# Altium schematic sheet BSU_EADC.SchDoc: ADC
size A4; Sub Team: EEE; Organization: PERT; SheetNumber: 7; SheetTotal: 8
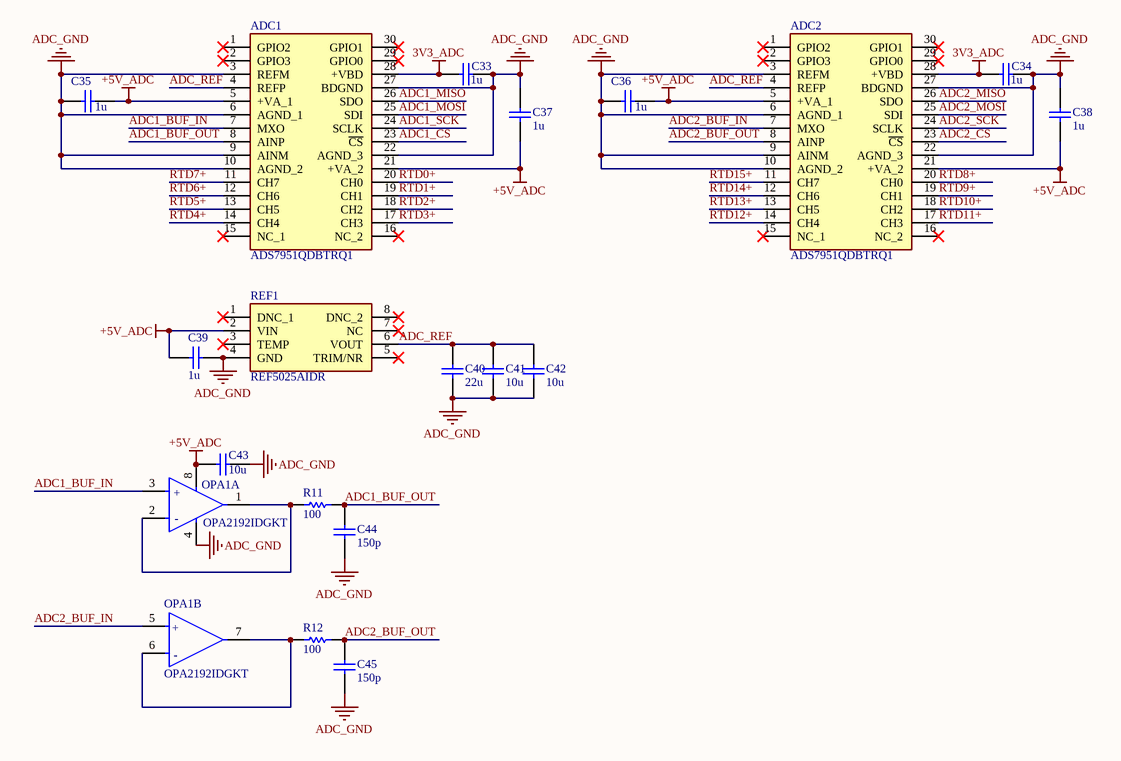
[diagram p0: BSU_EADC.SchDoc]

## Parts
ADC1  ADS7951QDBTRQ1  [TSSOP30_ADS7951]
ADC2  ADS7951QDBTRQ1  [TSSOP30_ADS7951]
C33  1u  [0805_SMD_C]
C34  1u  [0805_SMD_C]
C35  1u  [0805_SMD_C]
C36  1u  [0805_SMD_C]
C37  1u  [0805_SMD_C]
C38  1u  [0805_SMD_C]
C39  1u  [0805_SMD_C]
C40  22u  [0805_SMD_C]
C41  10u  [0805_SMD_C]
C42  10u  [0805_SMD_C]
C43  10u  [0805_SMD_C]
C44  150p  [0805_SMD_C]
C45  150p  [0805_SMD_C]
OPA1  OPA2192IDGKT  [VSSOP8_OPA2192]  (parts A,B of 2)
R11  100  [0805_SMD_R]
R12  100  [0805_SMD_R]
REF1  REF5025AIDR  [SOIC8_REF5025]

## Nets
3V3_ADC: ADC1.28(+VBD) ADC2.28(+VBD) C33.1 C34.1
+5V_ADC: ADC1.5(+VA_1) ADC1.21(+VA_2) ADC2.5(+VA_1) ADC2.21(+VA_2) C35.1 C36.1 C37.2 C38.2 C39.1 C43.2 OPA1.8(VDD) REF1.2(VIN)
ADC_GND: ADC1.3(REFM) ADC1.6(AGND_1) ADC1.9(AINM) ADC1.10(AGND_2) ADC1.22(AGND_3) ADC1.27(BDGND) ADC2.3(REFM) ADC2.6(AGND_1) ADC2.9(AINM) ADC2.10(AGND_2) ADC2.22(AGND_3) ADC2.27(BDGND) C33.2 C34.2 C35.2 C36.2 C37.1 C38.1 C39.2 C40.1 C41.1 C42.1 C43.1 C44.1 C45.1 OPA1.4(GND) REF1.4(GND)
ADC1_BUF_IN: ADC1.7(MXO) OPA1.3(1IN+)
ADC1_BUF_OUT: ADC1.8(AINP) C44.2 R11.2
ADC1_CS: ADC1.23(~{CS})
ADC1_MISO: ADC1.26(SDO)
ADC1_MOSI: ADC1.25(SDI)
ADC1_SCK: ADC1.24(SCLK)
ADC2_BUF_IN: ADC2.7(MXO) OPA1.5(2IN+)
ADC2_BUF_OUT: ADC2.8(AINP) C45.2 R12.2
ADC2_CS: ADC2.23(~{CS})
ADC2_MISO: ADC2.26(SDO)
ADC2_MOSI: ADC2.25(SDI)
ADC2_SCK: ADC2.24(SCLK)
ADC_REF: ADC1.4(REFP) ADC2.4(REFP) C40.2 C41.2 C42.2 REF1.6(VOUT)
RTD0+: ADC1.20(CH0)
RTD1+: ADC1.19(CH1)
RTD2+: ADC1.18(CH2)
RTD3+: ADC1.17(CH3)
RTD4+: ADC1.14(CH4)
RTD5+: ADC1.13(CH5)
RTD6+: ADC1.12(CH6)
RTD7+: ADC1.11(CH7)
RTD8+: ADC2.20(CH0)
RTD9+: ADC2.19(CH1)
RTD10+: ADC2.18(CH2)
RTD11+: ADC2.17(CH3)
RTD12+: ADC2.14(CH4)
RTD13+: ADC2.13(CH5)
RTD14+: ADC2.12(CH6)
RTD15+: ADC2.11(CH7)
NetOPA1_1: OPA1.1(1OUT) OPA1.2(1IN-) R11.1
NetOPA1_6: OPA1.6(2IN-) OPA1.7(2OUT) R12.1

Not connected (* = marked no-connect by the designer): ADC1 1(GPIO2)* 2(GPIO3)* 15(NC_1)* 16(NC_2)* 29(GPIO0)* 30(GPIO1)*; ADC2 1(GPIO2)* 2(GPIO3)* 15(NC_1)* 16(NC_2)* 29(GPIO0)* 30(GPIO1)*; REF1 1(DNC_1)* 3(TEMP)* 5(TRIM/NR)* 7(NC)* 8(DNC_2)*

## Notes on the sheet
- Title
- Generation
- Organization
- Sub Team
- Module
- Ver.
- Rev.
- Date
- Draw By
- (in symbol OPA2192IDGKT, part A) +; -
- (in symbol OPA2192IDGKT, part B) +; -

## Library data of the parts
ADC1 ADC2 = ADS7951QDBTRQ1: Automotive 12 bit, 1 MSPS, 8 Channel, Single-Ended, SAR ADC; Manufacturer_Name: Texas Instruments; Geometry.Height: 1.2mm; Mouser Part Number: 595-ADS7951QDBTRQ1; Mouser Price/Stock: https://www.mouser.co.uk/ProductDetail/Texas-Instruments/ADS7951QDBTRQ1?qs=gvhpkjpQEVRkli0uavTTsA%3D%3D; Manufacturer_Part_Number: ADS7951QDBTRQ1; Datasheet Link: http://www.ti.com/lit/gpn/ads7951-q1
C33-C45 = 0805_SMD_Capacitor: 0805 SMD Capacitor; Voltage Rating: 10VDC; Tolerance: *; Dielectric: *
  C33-C39: Value: 1u
  C40: Value: 22u
  C41-C43: Value: 10u
  C44 C45: Value: 150p
OPA1 = OPA2192IDGKT: 36-V, Precision, RRIO, Low Offset Voltage, Low Input Bias Current Op Amp With e-trim; Manufacturer_Name: Texas Instruments; Geometry.Height: 1.1mm; Mouser Part Number: 595-OPA2192IDGKT; Mouser Price/Stock: https://www.mouser.co.uk/ProductDetail/Texas-Instruments/OPA2192IDGKT?qs=UPLqB4C8V4F3vjA9o1ZbXA%3D%3D; Manufacturer_Part_Number: OPA2192IDGKT; Datasheet Link: http://www.ti.com/lit/gpn/opa2192
R11 R12 = 0805_SMD_Resistor: 0805 SMD Resistor; Tolerance: *; Power Rating: *; Temperature Coefficient: *; Value: 100
REF1 = REF5025AIDR: 3 Vpp/V Noise, 3 ppm/C Drift Precision Series Voltage Reference; Manufacturer_Name: Texas Instruments; Geometry.Height: 1.75mm; Mouser Part Number: 595-REF5025AIDR; Mouser Price/Stock: https://www.mouser.co.uk/ProductDetail/Texas-Instruments/REF5025AIDR?qs=xL7PkI2RoJ70M4JvRcjI4A%3D%3D; Manufacturer_Part_Number: REF5025AIDR; Datasheet Link: http://www.ti.com/lit/gpn/ref5025